# EAGLE design 2020_IST_Respirator_SMD_v3 (EAGLE 7.7.0)

## Sheet 1 of 4: Arduino Shield
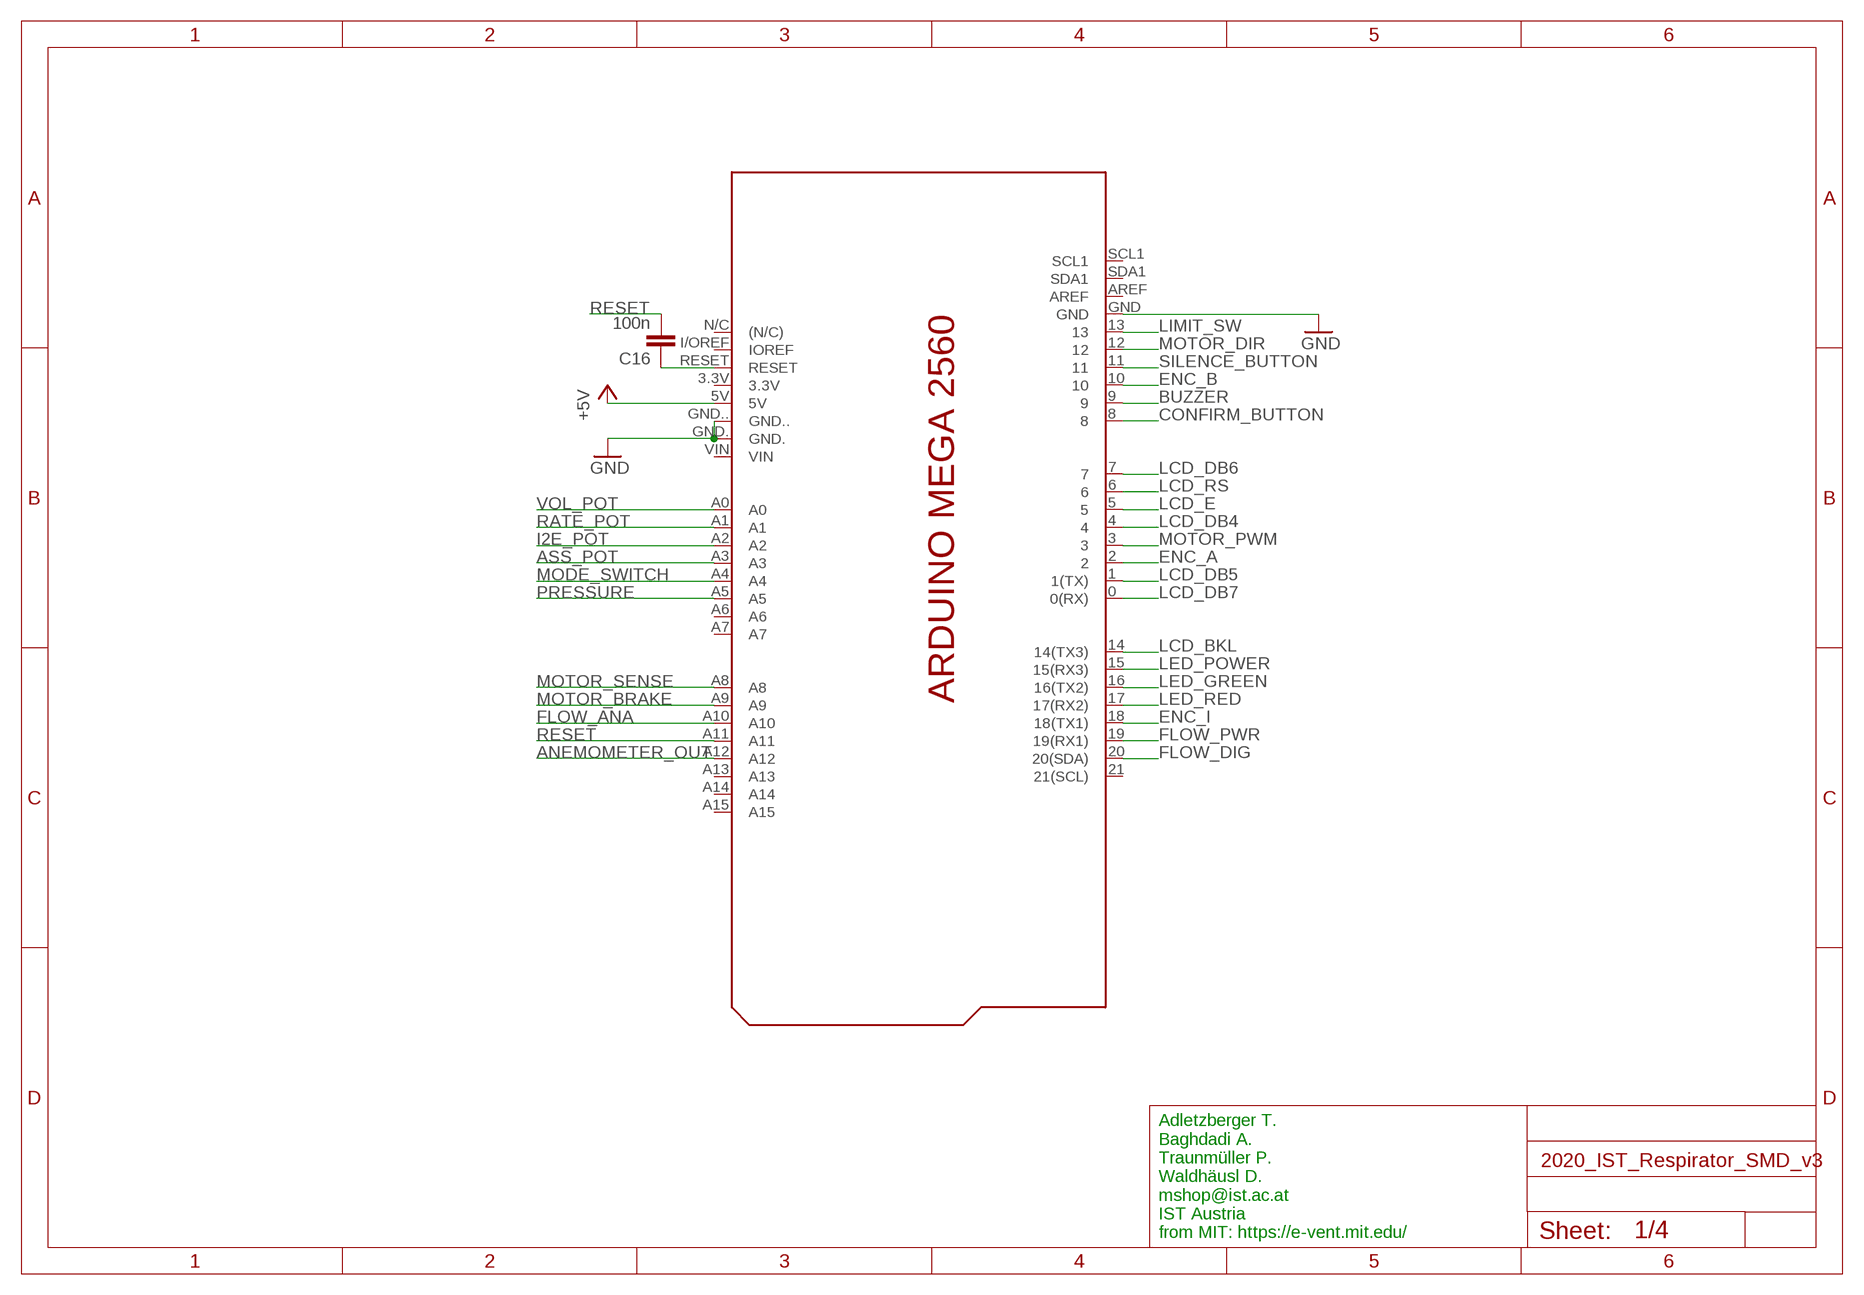
[diagram p0: schematic, sheet 1]

### Parts
C16  100n  C-EUC0805  [C0805]
PCB1  ARDUINO_MEGA2560_NOTALLPINS  [ARDUINO_MEGA2560_NOTALLPINS]

### Nets
+5V: PCB1.5V ; also sheet 2,3,4
ANEMOMETER_OUT: PCB1.A12
ASS_POT: PCB1.A3 ; also sheet 3
BUZZER: PCB1.9 ; also sheet 3
CONFIRM_BUTTON: PCB1.8 ; also sheet 3
ENC_A: PCB1.2 ; also sheet 4
ENC_B: PCB1.10 ; also sheet 4
ENC_I: PCB1.18(18(TX1)) ; also sheet 3,4
FLOW_ANA: PCB1.A10 ; also sheet 4
FLOW_DIG: PCB1.20(20(SDA)) ; also sheet 4
FLOW_PWR: PCB1.19(19(RX1)) ; also sheet 3,4
GND: PCB1.GND PCB1.GND. PCB1.GND.. ; also sheet 2,3,4
I2E_POT: PCB1.A2 ; also sheet 3
LCD_BKL: PCB1.14(14(TX3)) ; also sheet 3
LCD_DB4: PCB1.4 ; also sheet 3
LCD_DB5: PCB1.1(1(TX)) ; also sheet 3
LCD_DB6: PCB1.7 ; also sheet 3
LCD_DB7: PCB1.0(0(RX)) ; also sheet 3
LCD_E: PCB1.5 ; also sheet 3
LCD_RS: PCB1.6 ; also sheet 3
LED_GREEN: PCB1.16(16(TX2)) ; also sheet 3
LED_POWER: PCB1.15(15(RX3)) ; also sheet 3
LED_RED: PCB1.17(17(RX2)) ; also sheet 3
LIMIT_SW: PCB1.13 ; also sheet 3
MODE_SWITCH: PCB1.A4 ; also sheet 3
MOTOR_BRAKE: PCB1.A9
MOTOR_DIR: PCB1.12 ; also sheet 2
MOTOR_PWM: PCB1.3 ; also sheet 2
MOTOR_SENSE: PCB1.A8 ; also sheet 2
N$16: C16.1 PCB1.RESET
PRESSURE: PCB1.A5 ; also sheet 4
RATE_POT: PCB1.A1 ; also sheet 3
RESET: C16.2 PCB1.A11
SILENCE_BUTTON: PCB1.11 ; also sheet 3
VOL_POT: PCB1.A0 ; also sheet 3
Unconnected: PCB1.3.3V PCB1.21(21(SCL)) PCB1.A6 PCB1.A7 PCB1.A13 PCB1.A14 PCB1.A15 PCB1.AREF PCB1.I/OREF(IOREF) PCB1.N/C((N/C)) PCB1.SCL1 PCB1.SDA1 PCB1.VIN

### Notes on the sheet
- Adletzberger T.
  Baghdadi A.
  Traunmüller P.
  Waldhäusl D.
  mshop@ist.ac.at
  IST Austria 
  from MIT: https://e-vent.mit.edu/

## Sheet 2 of 4: Motor driver
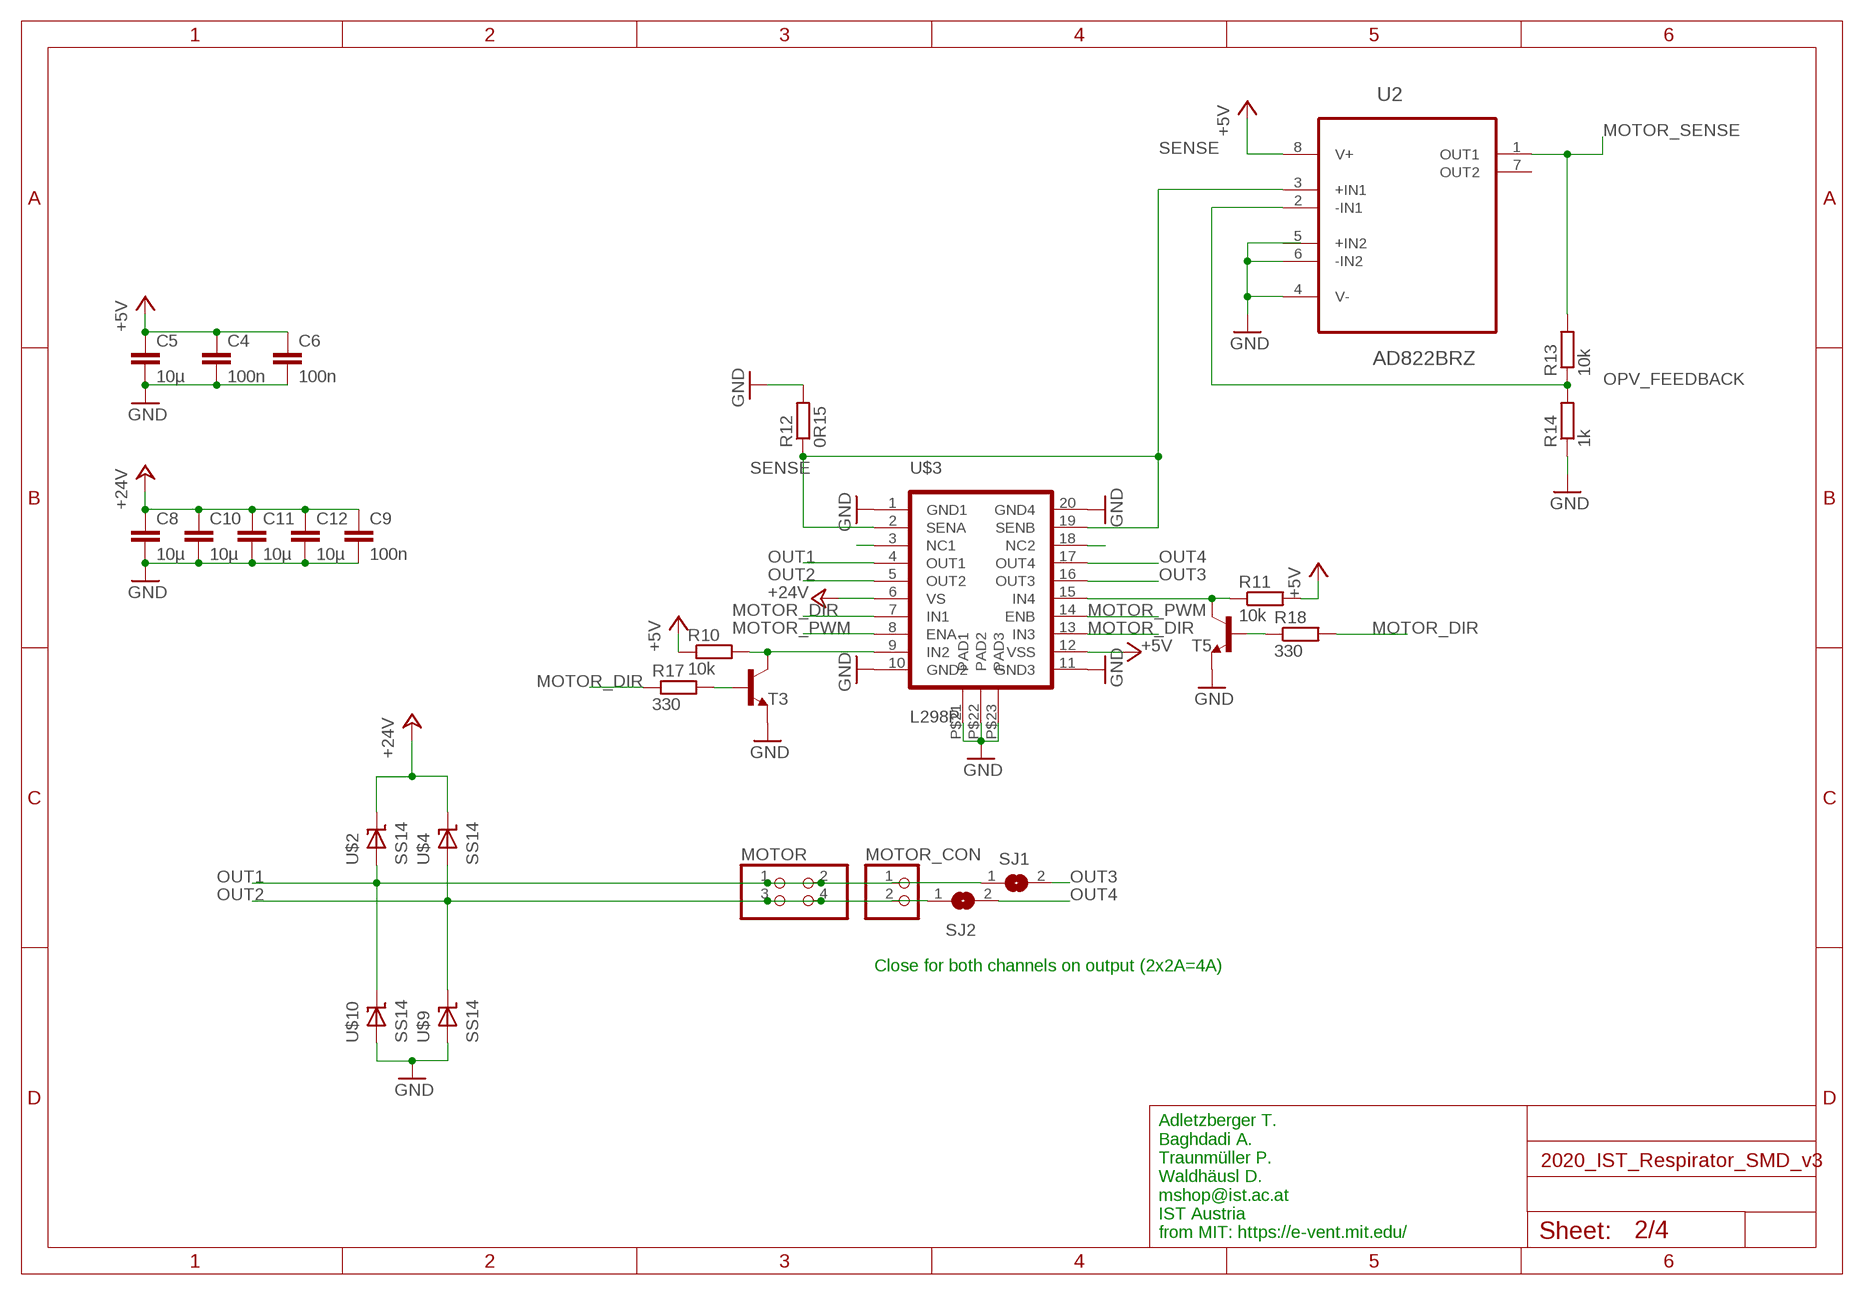
[diagram p1: schematic, sheet 2]

### Parts
C4  100n  C-EUC0805  [C0805]
C5  10µ  C-EUC1210  [C1210]
C6  100n  C-EUC0805  [C0805]
C8  10µ  C-EUC1210  [C1210]
C9  100n  C-EUC0805  [C0805]
C10  10µ  C-EUC1210  [C1210]
C11  10µ  C-EUC1210  [C1210]
C12  10µ  C-EUC1210  [C1210]
MOTOR  PINHD-2X2  [2X02]
MOTOR_CON  PINHD-1X2_3.93MM  [1X02_3.96MM]
R10  10k  R-EU_R0805  [R0805]
R11  10k  R-EU_R0805  [R0805]
R12  0R15  R-EU_R1206  [R1206]
R13  10k  R-EU_R0805  [R0805]
R14  1k  R-EU_R0805  [R0805]
R17  330  R-EU_R0805  [R0805]
R18  330  R-EU_R0805  [R0805]
SJ1  SJ  [SJ]
SJ2  SJ  [SJ]
T3  MMBT3904LT1-NPN-SOT23-BEC  [SOT23-BEC]
T5  MMBT3904LT1-NPN-SOT23-BEC  [SOT23-BEC]
U2  AD822BRZ  [SOIC127P600X175-8N]
U$2  SS14  [SMA]
U$3  L298P  [POWER-SO20]
U$4  SS14  [SMA]
U$9  SS14  [SMA]
U$10  SS14  [SMA]

### Nets
+5V: C4.1 C5.1 C6.1 R10.1 R11.2 U2.8(V+) U$3.P$12(VSS) ; also sheet 1,3,4
+24V: C8.1 C9.1 C10.1 C11.1 C12.1 U$2.P$1(K) U$3.P$6(VS) U$4.P$1(K) ; also sheet 3,4
DRIVER_IN2: R10.2 T3.C U$3.P$9(IN2)
DRIVER_INV4: R11.1 T5.C U$3.P$15(IN4)
GND: C4.2 C5.2 C6.2 C8.2 C9.2 C10.2 C11.2 C12.2 R12.2 R14.1 T3.E T5.E U2.4(V-) U2.6(-IN2) U$3.P$1(GND1) U$3.P$10(GND2) U$3.P$11(GND3) U$3.P$20(GND4) U$3.P$21(PAD1) U$3.P$22(PAD2) U$3.P$23(PAD3) U$9.P$2(A) U$10.P$2(A) ; also sheet 1,3,4
MOTOR_DIR: R17.1 R18.2 U$3.P$7(IN1) U$3.P$13(IN3) ; also sheet 1
MOTOR_PWM: U$3.P$8(ENA) U$3.P$14(ENB) ; also sheet 1
MOTOR_SENSE: R13.2 U2.1(OUT1) ; also sheet 1
N$8: U$3.P$18(NC2)
N$10: U$3.P$3(NC1)
N$14: R17.2 T3.B
N$15: R18.1 T5.B
OPV_FEEDBACK: R13.1 R14.2 U2.2(-IN1)
OUT1: MOTOR.1 MOTOR.2 MOTOR_CON.1 SJ1.1 U$2.P$2(A) U$3.P$4(OUT1) U$10.P$1(K)
OUT2: MOTOR.3 MOTOR.4 MOTOR_CON.2 SJ2.1 U$3.P$5(OUT2) U$4.P$2(A) U$9.P$1(K)
OUT3: SJ1.2 U$3.P$16(OUT3)
OUT4: SJ2.2 U$3.P$17(OUT4)
SENSE: R12.1 U2.3(+IN1) U$3.P$2(SENA) U$3.P$19(SENB)
Unconnected: U2.5(+IN2) U2.7(OUT2)

### Notes on the sheet
- Close for both channels on output (2x2A=4A)
- Adletzberger T.
  Baghdadi A.
  Traunmüller P.
  Waldhäusl D.
  mshop@ist.ac.at
  IST Austria 
  from MIT: https://e-vent.mit.edu/

## Sheet 3 of 4: Inputs & Outputs
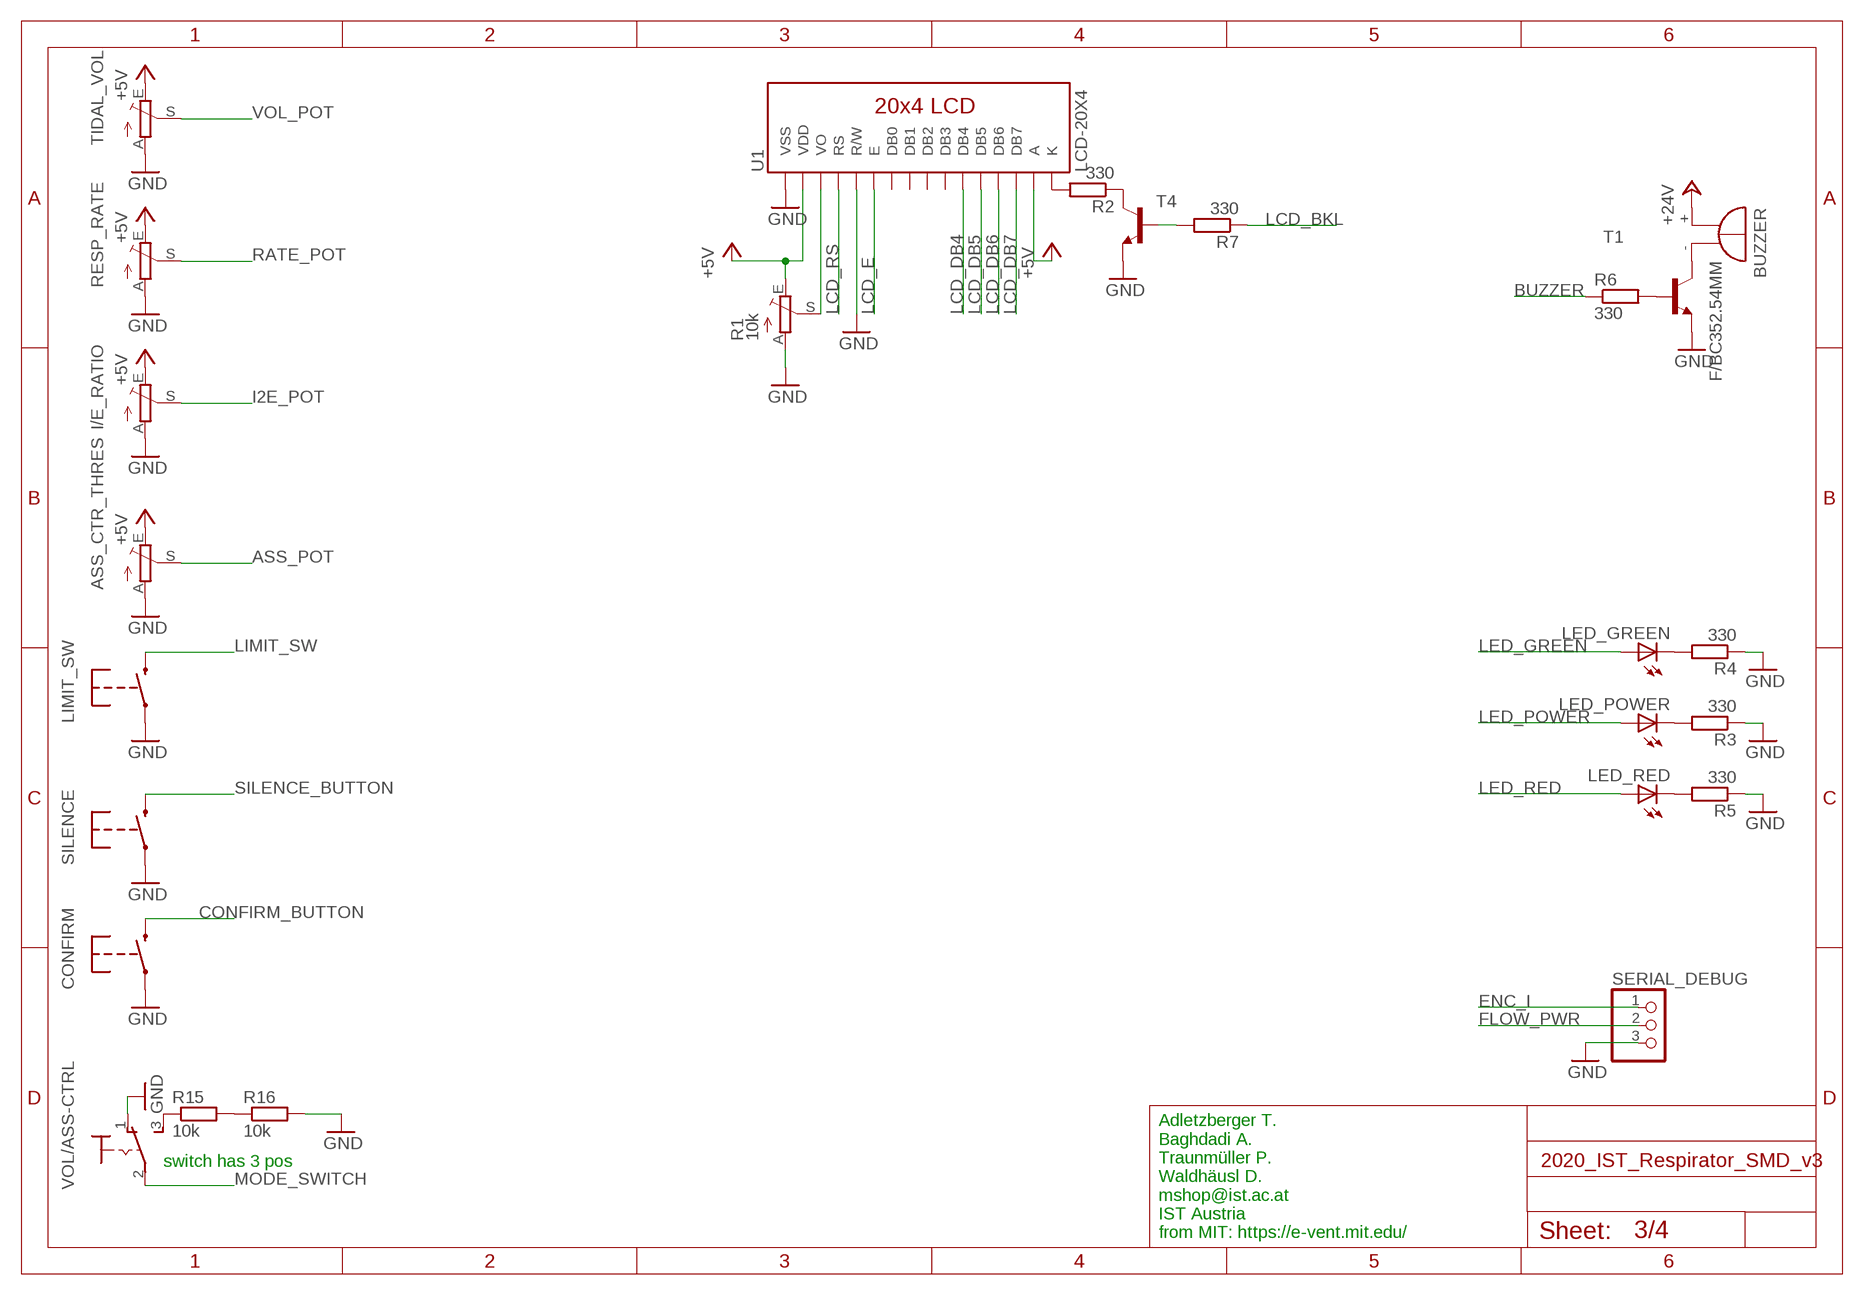
[diagram p2: schematic, sheet 3]

### Parts
ASS_CTR_THRES  TRIM_EU-ROUND  [S64W_ROUND-PADS]
BUZZER  F/BC352.54MM  [F/BC35_2.54MM]
CONFIRM  SWITCH-MOMENTARY-22.54  [TACTILE-2.54MM]
I/E_RATIO  TRIM_EU-ROUND  [S64W_ROUND-PADS]
LED_GREEN  LED5MM  [LED5MM]
LED_POWER  LED5MM  [LED5MM]
LED_RED  LED5MM  [LED5MM]
LIMIT_SW  SWITCH-MOMENTARY-22.54  [TACTILE-2.54MM]
R1  10k  TRIM_EU-S64W  [S64W]
R2  330  R-EU_R0805  [R0805]
R3  330  R-EU_R0805  [R0805]
R4  330  R-EU_R0805  [R0805]
R5  330  R-EU_R0805  [R0805]
R6  330  R-EU_R0805  [R0805]
R7  330  R-EU_R0805  [R0805]
R15  10k  R-EU_R0805  [R0805]
R16  10k  R-EU_R0805  [R0805]
RESP_RATE  TRIM_EU-ROUND  [S64W_ROUND-PADS]
SERIAL_DEBUG  PINHD-1X3  [1X03]
SILENCE  SWITCH-MOMENTARY-22.54  [TACTILE-2.54MM]
T1  MMBT3904LT1-NPN-SOT23-BEC  [SOT23-BEC]
T4  MMBT3904LT1-NPN-SOT23-BEC  [SOT23-BEC]
TIDAL_VOL  TRIM_EU-ROUND  [S64W_ROUND-PADS]
U1  LCD-20X4  [LCD-20X4]
VOL/ASS-CTRL  320-9162.54MM-ROUND-PADS  [320-916:2.54MM:ROUND-PADS]

### Nets
+5V: ASS_CTR_THRES.E I/E_RATIO.E R1.E RESP_RATE.E TIDAL_VOL.E U1.2(VDD) U1.15(A) ; also sheet 1,2,4
+24V: BUZZER.+ ; also sheet 2,4
ASS_POT: ASS_CTR_THRES.S ; also sheet 1
BUZZER: R6.1 ; also sheet 1
CONFIRM_BUTTON: CONFIRM.3 ; also sheet 1
ENC_I: SERIAL_DEBUG.1 ; also sheet 1,4
FLOW_PWR: SERIAL_DEBUG.2 ; also sheet 1,4
GND: ASS_CTR_THRES.A CONFIRM.1 I/E_RATIO.A LIMIT_SW.1 R1.A R3.1 R4.1 R5.1 R16.2 RESP_RATE.A SERIAL_DEBUG.3 SILENCE.1 T1.E T4.E TIDAL_VOL.A U1.1(VSS) U1.5(R/W) VOL/ASS-CTRL.1(O) ; also sheet 1,2,4
I2E_POT: I/E_RATIO.S ; also sheet 1
LCD_BKL: R7.1 ; also sheet 1
LCD_DB4: U1.11(DB4) ; also sheet 1
LCD_DB5: U1.12(DB5) ; also sheet 1
LCD_DB6: U1.13(DB6) ; also sheet 1
LCD_DB7: U1.14(DB7) ; also sheet 1
LCD_E: U1.6(E) ; also sheet 1
LCD_RS: U1.4(RS) ; also sheet 1
LED_GREEN: LED_GREEN.A ; also sheet 1
LED_POWER: LED_POWER.A ; also sheet 1
LED_RED: LED_RED.A ; also sheet 1
LIMIT_SW: LIMIT_SW.3 ; also sheet 1
MODE_SWITCH: VOL/ASS-CTRL.2(P) ; also sheet 1
N$4: BUZZER.- T1.C
N$5: R6.2 T1.B
N$6: R2.1 T4.C
N$7: R7.2 T4.B
N$9: R15.1 VOL/ASS-CTRL.3(S)
N$11: R15.2 R16.1
N$34: R2.2 U1.16(K)
N$37: R1.S U1.3(VO)
N$38: LED_GREEN.K(C) R4.2
N$39: LED_POWER.K(C) R3.2
N$40: LED_RED.K(C) R5.2
RATE_POT: RESP_RATE.S ; also sheet 1
SILENCE_BUTTON: SILENCE.3 ; also sheet 1
VOL_POT: TIDAL_VOL.S ; also sheet 1
Unconnected: U1.7(DB0) U1.8(DB1) U1.9(DB2) U1.10(DB3)

### Notes on the sheet
- switch has 3 pos
- Adletzberger T.
  Baghdadi A.
  Traunmüller P.
  Waldhäusl D.
  mshop@ist.ac.at
  IST Austria 
  from MIT: https://e-vent.mit.edu/

## Sheet 4 of 4: Supply & Sensors
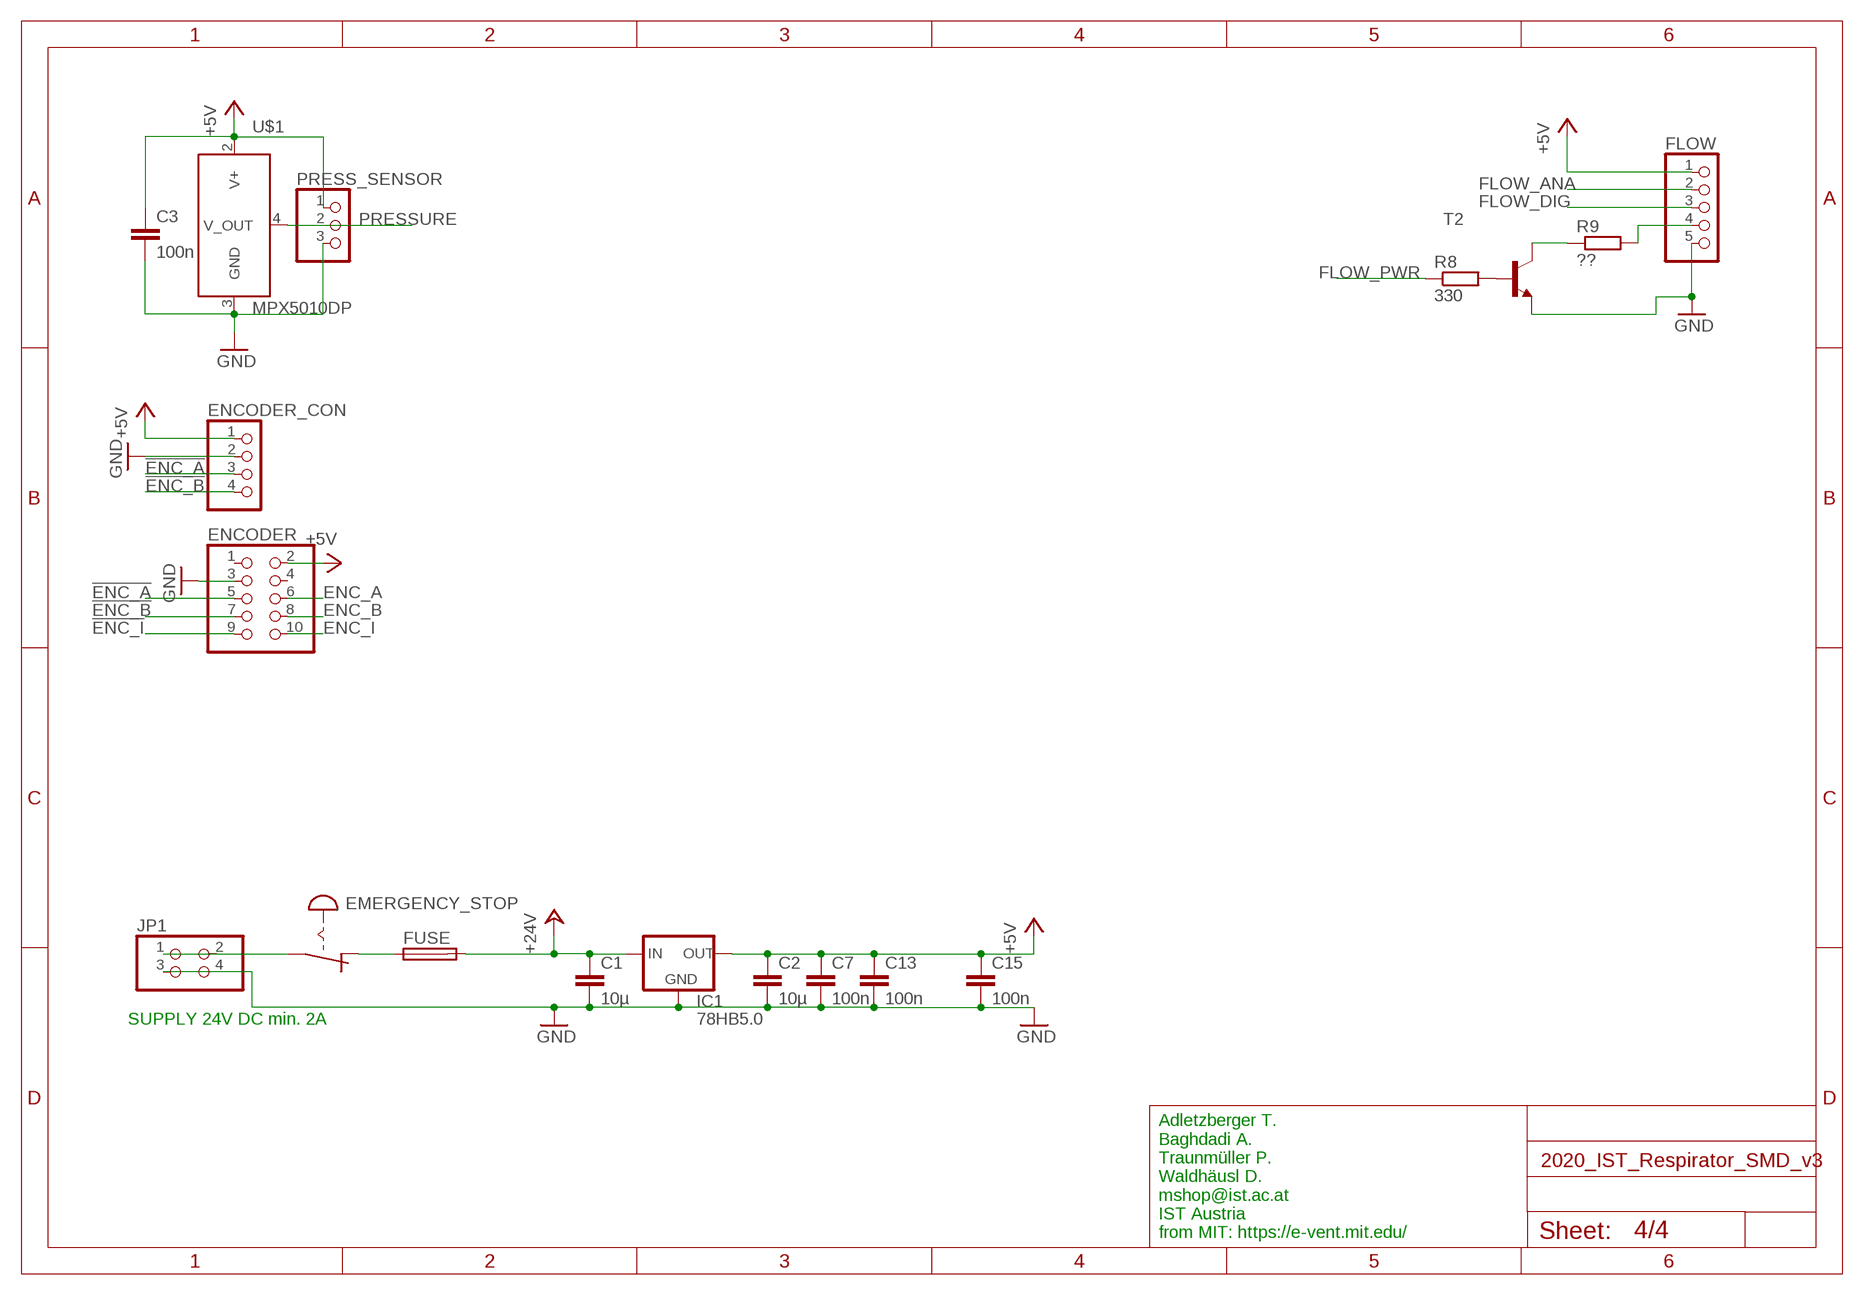
[diagram p3: schematic, sheet 4]

### Parts
C1  10µ  C-EUC1210  [C1210]
C2  10µ  C-EUC1210  [C1210]
C3  100n  C-EUC0805  [C0805]
C7  100n  C-EUC0805  [C0805]
C13  100n  C-EUC0805  [C0805]
C15  100n  C-EUC0805  [C0805]
EMERGENCY_STOP  EMERGENCY_STOP  [320-916:2.54MM:ROUND-PAD_2PINS]
ENCODER  PINHD-2X5  [2X05]
ENCODER_CON  PINHD-1X42MM  [1_04X2MM]
FLOW  PINHD-1X5  [1X05]
FUSE  SH22,5  [SH22,5]
IC1  78HB5.0  78XXS  [R-78HB]
JP1  PINHD-2X2  [2X02]
PRESS_SENSOR  PINHD-1X3  [1X03]
R8  330  R-EU_R0805  [R0805]
R9  ??  R-EU_R0805  [R0805]
T2  MMBT3904LT1-NPN-SOT23-BEC  [SOT23-BEC]
U$1  MPX5010DP  [MPX5010DP_SOP482]

### Nets
!ENC_A: ENCODER.5 ENCODER_CON.3
!ENC_B: ENCODER.7 ENCODER_CON.4
!ENC_I: ENCODER.9
+5V: C2.1 C3.1 C7.1 C13.1 C15.1 ENCODER.2 ENCODER_CON.1 FLOW.1 IC1.OUT PRESS_SENSOR.1 U$1.2(V+) ; also sheet 1,2,3
+24V: C1.1 FUSE.2 IC1.IN ; also sheet 2,3
ENC_A: ENCODER.6 ; also sheet 1
ENC_B: ENCODER.8 ; also sheet 1
ENC_I: ENCODER.10 ; also sheet 1,3
FLOW_ANA: FLOW.2 ; also sheet 1
FLOW_DIG: FLOW.3 ; also sheet 1
FLOW_PWR: R8.1 ; also sheet 1,3
GND: C1.2 C2.2 C3.2 C7.2 C13.2 C15.2 ENCODER.3 ENCODER_CON.2 FLOW.5 IC1.GND JP1.3 JP1.4 PRESS_SENSOR.3 T2.E U$1.3(GND) ; also sheet 1,2,3
N$1: R8.2 T2.B
N$2: R9.1 T2.C
N$3: FLOW.4 R9.2
N$12: EMERGENCY_STOP.2 JP1.1 JP1.2
N$13: EMERGENCY_STOP.1 FUSE.1
PRESSURE: PRESS_SENSOR.2 U$1.4(V_OUT) ; also sheet 1
Unconnected: ENCODER.1 ENCODER.4

### Notes on the sheet
- SUPPLY 24V DC min. 2A
- Adletzberger T.
  Baghdadi A.
  Traunmüller P.
  Waldhäusl D.
  mshop@ist.ac.at
  IST Austria 
  from MIT: https://e-vent.mit.edu/

## Library data of the parts
ASS_CTR_THRES I/E_RATIO R1 RESP_RATE TIDAL_VOL = pot:TRIM_EU-: POTENTIOMETER
BUZZER = buzzer:F/BC35: BUZZER Source: Spoerle
C1-C13 C15 C16 = rcl:C-EU: CAPACITOR, European symbol
CONFIRM LIMIT_SW SILENCE = SparkFun:SWITCH-MOMENTARY-2
EMERGENCY_STOP = switch:EMERGENCY_STOP: Emergency SWITCH distributor RS Components
ENCODER = pinhead:PINHD-2X5: PIN HEADER
ENCODER_CON = pinhead:PINHD-1X4: PIN HEADER
FLOW = pinhead:PINHD-1X5: PIN HEADER
FUSE = fuse:SH22,5: FUSE HOLDER grid 22,5 mm, OGN0031 8201, Schurter (Buerklin); MF: SCHURTER; MPN: 0031.8201; OC_FARNELL: 1162740; OC_NEWARK: 96F8317
IC1 = v-reg:78XXS: VOLTAGE REGULATOR
JP1 MOTOR = pinhead:PINHD-2X2: PIN HEADER
LED_GREEN LED_POWER LED_RED = led:LED: LED OSRAM: - CHIPLED LG R971, LG N971, LY N971, LG Q971, LY Q971, LO R971, LY R971 LH N974, LH R974 LS Q976, LO Q976, LY Q976 LO Q996 - Hyper CHIPLED LW Q18S LB Q993, LB Q99A, LB R99A - SideLED LS A670, LO A670, LY A670, LG A670, LP A670 LB A673, LV A673, LT A673, LW A673 LH A674 LY A675 LS A676, LA A676, LO A676, LY A676, LW A676 LS A679, LY A679, LG A679 - Hyper Micro SIDELED® LS Y876, LA Y876, LO Y876, LY Y876 LT Y87S - SmartLED LW L88C, LW L88S LB L89C, LB L89S, LG L890 LS L89K, LO L89K, LY L89K LS L896, LA L896, LO L896, LY L896 - TOPLED LS T670, LO T670, LY T670, LG T670, LP T670 LSG T670, LSP T670, LSY T670, LOP T670, LYG T670 LG T671, LOG T671, LSG T671 LB T673, LV T673, LT T673, LW T673 LH T674 LS T676, LA T676, LO T676, LY T676, LB T676, LH T676, LSB T676, LW T676 LB T67C, LV T67C, LT T67C, LS T67K, LO T67K, LY T67K, LW E67C LS E67B, LA E67B, LO E67B, LY E67B, LB E67C, LV E67C, LT E67C LW T67C LS T679, LY T679, LG T679 LS T770, LO T770, LY T770, LG T770, LP T770 LB T773, LV T773, LT T773, LW T773 LH T774 LS E675, LA E675, LY E675, LS T675 LS T776, LA T776, LO T776, LY T776, LB T776 LHGB T686 LT T68C, LB T68C - Hyper Mini TOPLED® LB M676 - Mini TOPLED Santana® LG M470 LS M47K, LO M47K, LY M47K Source: http://www.osram.convergy.de LUXEON: - LUMILED® LXK2-PW12-R00, LXK2-PW12-S00, LXK2-PW14-U00, LXK2-PW14-V00 LXK2-PM12-R00, LXK2-PM12-S00, LXK2-PM14-U00 LXK2-PE12-Q00, LXK2-PE12-R00, LXK2-PE12-S00, LXK2-PE14-T00, LXK2-PE14-U00 LXK2-PB12-K00, LXK2-PB12-L00, LXK2-PB12-M00, LXK2-PB14-N00, LXK2-PB14-P00, LXK2-PB14-Q00 LXK2-PR12-L00, LXK2-PR12-M00, LXK2-PR14-Q00, LXK2-PR14-R00 LXK2-PD12-Q00, LXK2-PD12-R00, LXK2-PD12-S00 LXK2-PH12-R00, LXK2-PH12-S00 LXK2-PL12-P00, LXK2-PL12-Q00, LXK2-PL12-R00 Source: www.luxeon.com KINGBRIGHT: KA-3528ASYC Source: www.kingbright.com
MOTOR_CON = pinhead:PINHD-1X2: PIN HEADER
PCB1 = E14_Arduino_revB:ARDUINO_MEGA2560_NOTALLPINS: Device for representing an Arduino Mega 2560 board with a footprint in an EAGLE design. Created by Dave Young for Element14. More EAGLE documentation at: http://www.element14.com/community/community/knode/cadsoft_eagle
PRESS_SENSOR SERIAL_DEBUG = pinhead:PINHD-1X3: PIN HEADER
R2-R18 = rcl:R-EU_: RESISTOR, European symbol
SJ1 SJ2 = jumper:SJ: SMD solder JUMPER
T1-T5 = transistor:*-NPN-: NPN Transistror BF959 corrected 2008.03.06
U1 = SparkFun:LCD-20X4
U2 = Analog Devices_By_element14_Batch_1:AD822BRZ: Single-Supply, Rail-to-Rail Single-Supply, Rail-to-Rail Low Power FET-Input Op Amp; MPN: AD822BRZ; OC_FARNELL: 1651303; OC_NEWARK: 59K6493; PACKAGE: SOIC-8; SUPPLIER: Analog Devices
U$1 = SparkFun:MPX5010DP: MPX5010 Pressure Sensor Differential/Gauge Pressure Sensors up to 10 kPa, NXP MEMS-based low-pressure differential/gauge sensors measure the difference in pressure between sources when pressure is applied to both sides of the sensor (differential) and atmospheric pressure (gauged). Pressure Sensors, NXP RS Stock No. 922-7409 Mfr. Part No. MPXV5010DP
U$2 U$4 U$9 U$10 = SmartPrj:SS14: DIODE SS14 Diode Schottky 1A 40v
U$3 = SmartPrj:L298P: L298P DUAL FUL-BRIDGE DRIVER PowerSO20
VOL/ASS-CTRL = switch:320-916: TOGGLE SWITCH distributor RS Components

## Net classes
0 default: clearance 0.205 mm

## Board
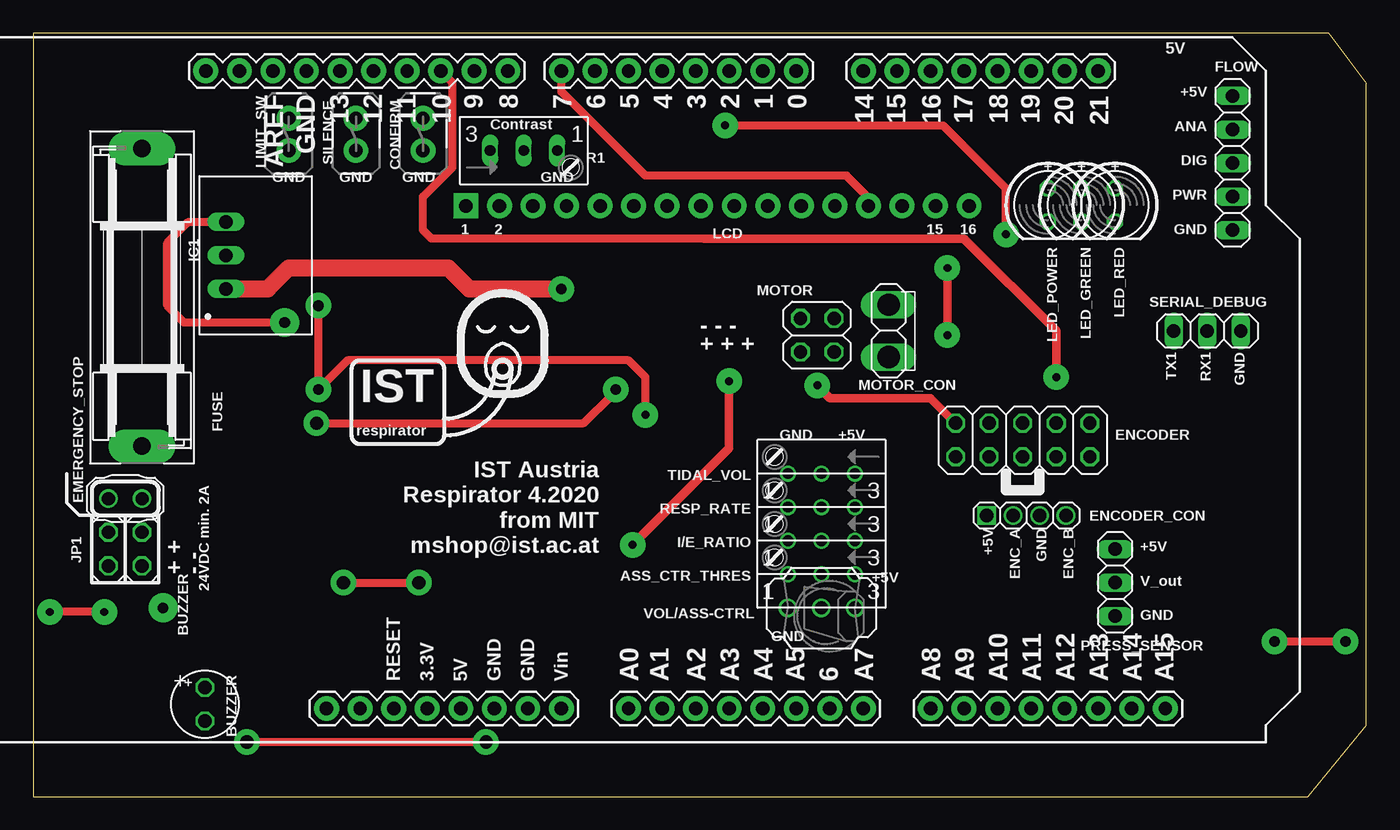
[diagram p4: board, top side]
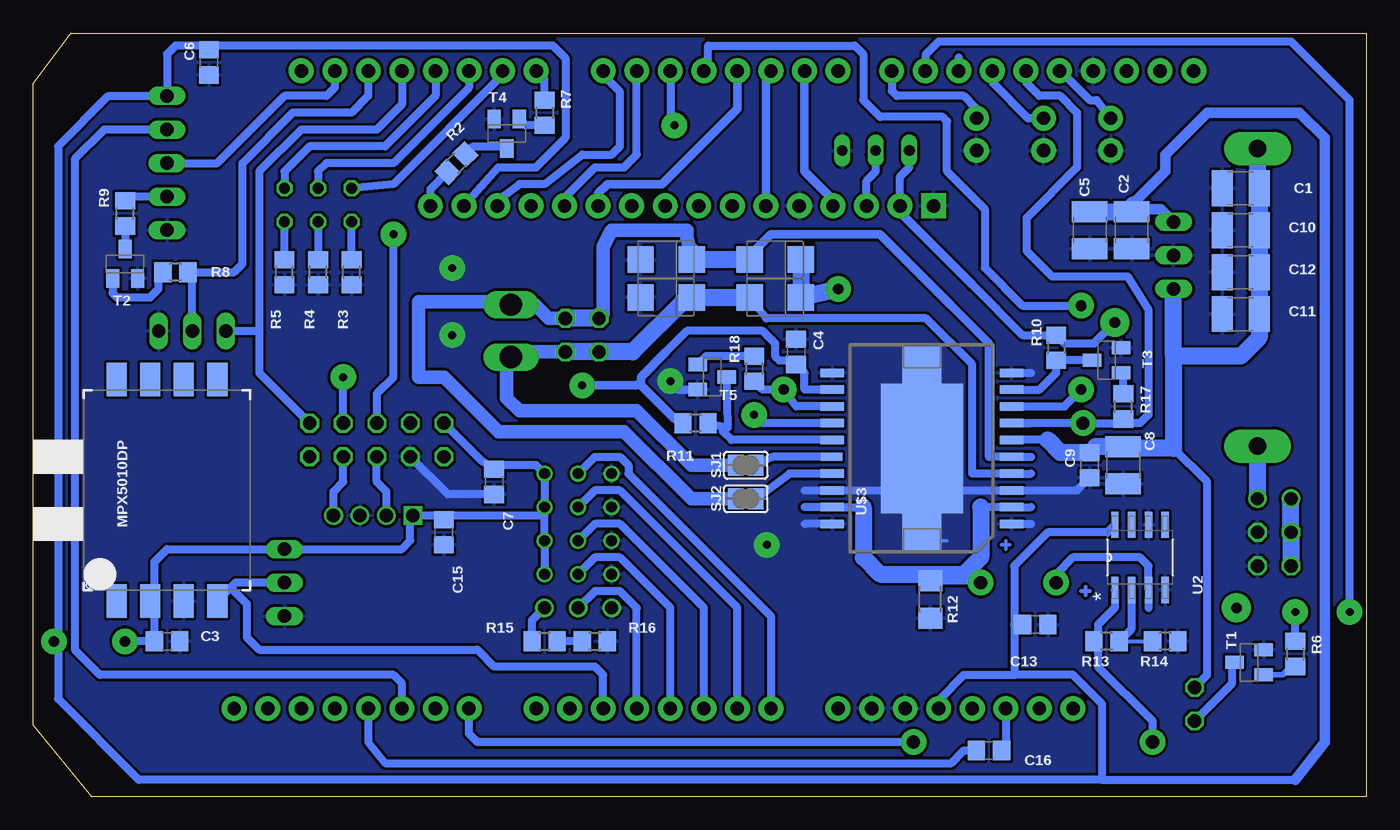
[diagram p5: board, bottom side, seen from below]

Size 100.95 x 57.79 mm. Coordinates in mm from the lower left corner, seen from the top.
Outline: 0,0 96.52,0 100.95,5.4 100.95,53.97 98.11,57.79 0,57.79 0,0
Copper layers (1*16): Top 0.035mm / dielectric 1.5mm / Bottom 0.035mm
Design rules "PCB-POOL Standard": minimum track width 0.15mm, minimum drill 0.3mm, track to track 0.15mm, track to pad 0.15mm, pad to pad 0.15mm, via to via 0.15mm, smd to smd 0.15mm, copper to edge 0.3mm, drill to drill 0.2mm, minimum pad ring 0.2mm, minimum via ring 0.15mm, stop-mask expansion 0.075mm, vias tented up to drill 0mil, thermal gap 0.2mm

### Footprints (pad centres in the part's own frame; a part is rotated, then mirrored left to right if it is on the bottom)
S64W_ROUND-PADS = drill 0.813: A 2.54,1.27; E -2.54,1.27; S 0,1.27
F/BC35_2.54MM = drill 1 octagon: + 1.27,0; - -1.27,0
C1210 = smd 1.6 x 2.7: 1 -1.4,0; 2 1.4,0
C0805 = smd 1.3 x 1.5: 1 -0.95,0; 2 0.95,0
TACTILE-2.54MM = drill 1.016 pad 1.88: 1 0,1.27; 3 0,-1.17
320-916:2.54MM:ROUND-PAD_2PINS = drill 1: 1 0,2.54; 2 0,0
2X05 = drill 1.016 octagon: 1 -5.08,-1.27; 2 -5.08,1.27; 3 -2.54,-1.27; 4 -2.54,1.27; 5 0,-1.27; 6 0,1.27; 7 2.54,-1.27; 8 2.54,1.27; 9 5.08,-1.27; 10 5.08,1.27
1_04X2MM = drill 1.016 pad 1.3 square: 1 -4,0 | drill 1.016 pad 1.3: 2 0,0; 3 -2,0; 4 2,0
1X05 = drill 1.016 long: 1 -5.08,0; 2 -2.54,0; 3 0,0; 4 2.54,0; 5 5.08,0
SH22,5 = drill 1.321 pad 2.54 long: 1 -11.252,0; 2 11.252,0
R-78HB = drill 1.016 long: GND 0,0; IN -2.54,0; OUT 2.54,0
2X02 = drill 1.016 octagon: 1 -1.27,-1.27; 2 -1.27,1.27; 3 1.27,-1.27; 4 1.27,1.27
LED5MM = drill 0.813 octagon: A -1.27,0; K 1.27,0
1X02_3.96MM = drill 1.7 long: 1 1.98,0; 2 -1.98,0
ARDUINO_MEGA2560_NOTALLPINS = drill 1.016 pad 1.88: 0 63.5,50.8; 1 60.96,50.8; 2 58.42,50.8; 3 55.88,50.8; 3.3V 35.56,2.54; 4 53.34,50.8; 5 50.8,50.8; 5V 38.1,2.54; 6 48.26,50.8; 7 45.72,50.8; 8 41.656,50.8; 9 39.116,50.8; 10 36.576,50.8; 11 34.036,50.8; 12 31.496,50.8; 13 28.956,50.8; 14 68.58,50.8; 15 71.12,50.8; 16 73.66,50.8; 17 76.2,50.8; 18 78.74,50.8; 19 81.28,50.8; 20 83.82,50.8; 21 86.36,50.8; A0 50.8,2.54; A1 53.34,2.54; A2 55.88,2.54; A3 58.42,2.54; A4 60.96,2.54; A5 63.5,2.54; A6 66.04,2.54; A7 68.58,2.54; A8 73.66,2.54; A9 76.2,2.54; A10 78.74,2.54; A11 81.28,2.54; A12 83.82,2.54; A13 86.36,2.54; A14 88.9,2.54; A15 91.44,2.54; AREF 23.876,50.8; GND 26.416,50.8; GND. 43.18,2.54; GND.. 40.64,2.54; I/OREF 30.48,2.54; N/C 27.94,2.54; RESET 33.02,2.54; SCL1 18.796,50.8; SDA1 21.336,50.8; VIN 45.72,2.54
1X03 = drill 1.016 long: 1 -2.54,0; 2 0,0; 3 2.54,0
S64W = drill 0.813 long: A 2.54,1.27; E -2.54,1.27; S 0,1.27
R0805 = smd 1.3 x 1.5: 1 -0.95,0; 2 0.95,0
R1206 = smd 1.6 x 1.803: 1 -1.422,0; 2 1.422,0
SJ = smd 1.168 x 1.6: 1 -0.762,0; 2 0.762,0
SOT23-BEC = smd 1 x 1.4: B -0.95,-1.1; C 0,1.1; E 0.95,-1.1
LCD-20X4 = drill 1.016 pad 1.88 square: 1 -19.3,0.26 | drill 1.016 pad 1.88: 2 -16.76,0.26; 3 -14.22,0.26; 4 -11.68,0.26; 5 -9.14,0.26; 6 -6.6,0.26; 7 -4.06,0.26; 8 -1.52,0.26; 9 1.02,0.26; 10 3.56,0.26; 11 6.1,0.26; 12 8.64,0.26; 13 11.18,0.26; 14 13.72,0.26; 15 16.26,0.26; 16 18.8,0.26
SOIC127P600X175-8N = smd 1.981 x 0.559: 1 -2.464,1.905; 2 -2.464,0.635; 3 -2.464,-0.635; 4 -2.464,-1.905; 5 2.464,-1.905; 6 2.464,-0.635; 7 2.464,0.635; 8 2.464,1.905
MPX5010DP_SOP482 = smd 2.54 x 1.524: 1 -8.382,3.81; 2 -8.382,1.27; 3 -8.382,-1.27; 4 -8.382,-3.81; 5 8.382,-3.81; 6 8.382,-1.27; 7 8.382,1.27; 8 8.382,3.81
SMA = smd 2 x 2: P$1 -1.94,0; P$2 1.94,0
POWER-SO20 = smd 0.635 x 1.778: P$1 -5.715,-6.782; P$2 -4.445,-6.782; P$3 -3.175,-6.782; P$4 -1.905,-6.782; P$5 -0.635,-6.782; P$6 0.635,-6.782; P$7 1.905,-6.782; P$8 3.175,-6.782; P$9 4.445,-6.782; P$10 5.715,-6.782; P$11 5.715,6.782; P$12 4.445,6.782; P$13 3.175,6.782; P$14 1.905,6.782; P$15 0.635,6.782; P$17 -1.905,6.782; P$18 -3.175,6.782; P$19 -4.445,6.782; P$20 -5.715,6.782 | smd 0.635 x 1.651: P$16 -0.635,6.833 | smd 9.804 x 6.198: P$21 0,0 | smd 3.048 x 2.921: P$22 -6.426,0; P$23 6.426,0
320-916:2.54MM:ROUND-PADS = drill 1: 1 0,2.54; 2 0,0; 3 0,-2.54

### Placement (x,y rotation side)
ASS_CTR_THRES  59.69,18.1 180 top
BUZZER  13.02,6.99 90 top
C1  9.53,46.04 180 bottom
C2  17.78,42.86 270 bottom
C3  90.81,11.75 0 bottom
C4  43.18,33.66 90 bottom
C5  20.95,42.86 270 bottom
C6  87.63,55.56 270 bottom
C7  66.04,23.81 270 bottom
C8  18.41,25.08 270 bottom
C9  20.95,25.08 270 bottom
C10  9.53,42.86 180 bottom
C11  9.53,36.51 180 bottom
C12  9.53,39.69 180 bottom
C13  25.08,13.02 0 bottom
C15  69.85,20 270 bottom
C16  28.57,3.49 180 bottom
CONFIRM  29.53,50.16 180 top
EMERGENCY_STOP  5.71,22.54 270 top
ENCODER  74.93,26.99 0 top
ENCODER_CON  76.2,21.27 0 top
FLOW  90.81,47.94 270 top
FUSE  8.25,37.78 90 top
I/E_RATIO  59.69,20.64 180 top
IC1  14.61,40.96 90 top
JP1  6.99,18.73 0 top
LED_GREEN  79.38,44.77 270 top
LED_POWER  76.84,44.77 270 top
LED_RED  81.92,44.77 270 top
LIMIT_SW  19.37,50.16 180 top
MOTOR  59.37,34.93 90 top
MOTOR_CON  64.77,35.24 270 top
PCB1  -5.72,4.13 0 top
PRESS_SENSOR  81.92,16.19 270 top
R1  37.15,47.62 0 top
R2  68.9,47.94 225 bottom
R3  76.84,39.69 90 bottom
R4  79.38,39.69 90 bottom
R5  81.92,39.69 90 bottom
R6  5.4,10.79 270 bottom
R7  62.23,51.75 270 bottom
R8  90.17,39.69 180 bottom
R9  93.98,44.13 90 bottom
R10  23.49,33.97 270 bottom
R11  50.8,28.26 180 bottom
R12  33.02,14.92 270 bottom
R13  19.68,11.75 180 bottom
R14  15.24,11.75 180 bottom
R15  62.23,11.75 0 bottom
R16  58.42,11.75 0 bottom
R17  18.41,29.53 90 bottom
R18  46.35,32.39 270 bottom
RESP_RATE  59.69,23.18 180 top
SERIAL_DEBUG  88.9,35.24 0 top
SILENCE  24.45,50.16 180 top
SJ1  46.99,25.08 0 bottom
SJ2  46.99,22.54 0 bottom
T1  8.89,10.16 90 bottom
T2  93.98,40.32 0 bottom
T3  19.68,33.02 90 bottom
T4  65.09,50.16 180 bottom
T5  49.53,31.75 270 bottom
TIDAL_VOL  59.69,25.72 180 top
U1  52.07,44.45 0 top
U2  17.14,18.1 90 bottom
U$1  90.81,23.18 90 bottom
U$2  44.77,37.78 180 bottom
U$3  33.66,26.35 90 bottom
U$4  44.77,40.64 180 bottom
U$9  53.02,40.64 180 bottom
U$10  53.02,37.78 180 bottom
VOL/ASS-CTRL  59.69,14.29 90 top

### Tracks (layer width: path | path; a pad name or v marks a point on that pad's centre or on a via)
!ENC_A
  Bottom 0.61: ENCODER_CON.3 74.2,23.08 74.93,23.81 ENCODER.5
!ENC_B
  Bottom 0.61: ENCODER_CON.4 78.2,23.08 77.47,23.81 ENCODER.7
+5V  (via drill 0.6 pad 1.93, 0.8 pad 1.93, 0.8 pad 2.18)
  Top 0.61: v93.98,11.75 v99.38,11.75 | 67.95,30.16 ENCODER.2 | v19.05,35.88 11.43,35.88 10.16,37.15 10.16,41.91 11.75,43.5 IC1.OUT
  Top 0.64: 67.95,30.16 60.32,30.16 v59.37,31.11
  Bottom 0.61: 91.76,14.48 C3.1 v93.98,11.75 | 91.76,14.48 U$1.2 | 69.85,21.27 ENCODER_CON.1 72.39,21.08 72.39,19.37 73.03,18.73 PRESS_SENSOR.1 90.81,18.73 91.76,17.78 91.76,14.48 | 69.85,21.27 62.23,21.27 | 62.23,21.27 RESP_RATE.E TIDAL_VOL.E 62.87,25.08 66.36,25.08 C7.1 66.99,25.4 ENCODER.2 | ASS_CTR_THRES.E I/E_RATIO.E 62.23,21.27 | C15.1 69.85,21.27 | U$3.P$12 42.54,30.8 42.54,32.07 C4.1 43.49,33.02 44.45,33.02 44.77,33.34 44.77,34.29 45.72,35.24 51.44,35.24 53.02,33.65 | 99.06,11.75 99.06,49.21 95.25,53.02 FLOW.1 90.81,56.2 90.17,56.83 87.63,56.83 | 99.06,11.75 99.06,7.39 92.94,1.27 20,1.27 | PCB1.5V 32.38,7.3 30.48,9.21 26.67,9.21 | v99.38,11.75 99.06,11.75 | 26.67,13.02 26.67,17.46 24.13,20 19.61,20 U2.8 | 26.67,13.02 26.67,9.21 | 26.67,9.21 22.22,9.21 20,6.99 20,1.27 | 87.63,56.83 61.59,56.83 60.64,55.88 60.64,49.85 62.87,47.62 65.72,47.62 U1.15 | R11.2 51.75,28.57 | C13.1 26.67,13.02 | v19.05,35.88 20.64,34.29 22.86,34.29 R10.1 26.03,34.92 29.84,38.73 | R1.E 34.61,47.62 35.31,46.92 U1.2 | 20,1.27 5.4,1.27 | C6.1 87.63,56.83
  Bottom 0.64: 53.02,33.65 54.93,31.75 54.93,31.43 | 54.93,31.43 54.93,31.11 52.39,28.58 52.07,28.58 R11.2 | v59.37,31.11 55.24,31.11 54.93,31.43 | 29.84,38.73 35.24,44.13 35.24,44.64 U1.2
  Bottom 0.813: 5.4,1.27 3.17,4.13 3.17,49.85 5.08,51.75 12.07,51.75 15.24,48.58 15.24,47.31 17.65,44.9 17.65,44.77 17.33,44.45 15.56,44.45 IC1.OUT
  Bottom 1.27: 17.65,44.77 C2.1 C5.1
+24V  (via drill 0.8 pad 1.93)
  Top 1.27: IC1.IN 17.78,38.42 19.37,40.01 31.43,40.01 33.02,38.42 v40.01,38.42
  Bottom 0.61: 24.13,26.99 U$3.P$6 | BUZZER.+ 12.07,9.21 12.07,23.81 14.61,26.35
  Bottom 1.27: FUSE.2 8.25,46.8 C1.1 C10.1 C12.1 C11.1 | C11.1 8.12,36.01 8.25,35.88 8.25,37.02 C11.1 | C11.1 8.12,34.74 9.53,33.34 14.61,33.34 | 14.61,33.34 IC1.IN | U$4.P$1 U$2.P$1 v40.01,38.42 | 14.61,33.34 14.61,26.35 18.29,26.35 C8.1 20.5,26.48 C9.1 23.18,26.03 24.13,26.99
ASS_POT
  Bottom 0.61: PCB1.A3 52.7,14.29 56.52,18.1 58.42,18.1 ASS_CTR_THRES.S
BUZZER  (via drill 0.6 pad 1.93)
  Top 0.61: v5.4,13.97 v1.27,13.97
  Bottom 0.61: PCB1.9 33.34,54.99 33.34,56.2 32.38,57.15 5.71,57.15 1.27,52.71 v1.27,13.97 | R6.1 v5.4,13.97
CONFIRM_BUTTON
  Bottom 0.61: PCB1.8 35.94,53.4 35.56,53.02 30.48,53.02 29.53,52.07 CONFIRM.3
DRIVER_IN2
  Bottom 0.61: U$3.P$9 24.77,30.8 23.49,32.07 R10.2 T3.C
DRIVER_INV4
  Bottom 0.61: U$3.P$15 48.09,26.99 48.73,27.62 48.35,27.92 | 48.35,27.92 T5.C | R11.1 49.83,28.24 48.35,27.92
ENC_A  (via drill 0.6 pad 1.93)
  Top 0.61: v52.39,50.8 68.9,50.8 73.66,46.04 v73.66,42.54
  Bottom 0.61: PCB1.2 52.7,51.12 v52.39,50.8 | ENCODER.6 74.93,30.48 73.66,31.75 v73.66,42.54
ENC_B  (via drill 0.6 pad 1.93)
  Top 0.61: v77.47,31.75 77.15,31.75 | 50.8,42.23 30.16,42.23 29.53,42.86 29.53,45.4 31.75,47.62 31.75,54.04 PCB1.10
  Top 0.64: 50.8,42.23 70.48,42.23 77.47,35.24 v77.47,31.75
  Bottom 0.61: PCB1.10 30.86,55.94 | ENCODER.8 v77.47,31.75
ENC_I
  Bottom 0.61: PCB1.18 73.03,52.39 74.93,50.48 80.65,50.48 83.82,47.31 83.82,35.24 | 83.82,35.24 83.82,32.07 ENCODER.10 | SERIAL_DEBUG.1 83.82,35.24
FLOW_ANA
  Bottom 0.61: PCB1.A10 73.03,8.57 73.66,9.21 95.89,9.21 97.79,11.11 97.79,48.26 95.57,50.48 FLOW.2
FLOW_DIG
  Bottom 0.61: PCB1.20 78.11,53.66 78.74,53.02 81.92,53.02 87,47.94 FLOW.3
FLOW_PWR
  Bottom 0.61: PCB1.19 75.57,53.02 76.84,51.75 81.28,51.75 85.09,47.94 85.09,40.32 85.73,39.69 R8.1 88.9,39.37 SERIAL_DEBUG.2
GND  (via drill 0.6 pad 1.93)
  Top 0.64: v69.22,34.93 v69.22,40.01 | v52.7,31.43 52.7,26.35 v45.4,19.05
  Bottom 0.254: 31.75,19.37 33.02,19.37 36.2,22.54 36.2,23.18
  Bottom 0.61: 42.55,23.18 36.2,23.18 21.91,23.18 C9.2 | U$3.P$20 42.55,20.64 | U$3.P$1 25.4,20.64 | U$3.P$10 25.4,32.07 | C7.2 69.54,22.86 ENCODER.3
  Bottom 0.64: T5.E 52.07,30.8 v52.7,31.43
  pour Bottom: 0,57.79 0,0 96.2,0 100.65,5.08 100.97,53.98 97.79,57.79
I2E_POT
  Bottom 0.61: PCB1.A2 50.16,14.29 56.52,20.64 58.42,20.64 I/E_RATIO.S
LCD_BKL
  Bottom 0.61: R7.1 62.23,54.29 PCB1.14
LCD_DB4
  Bottom 0.64: U1.11 58.17,45.65 57.47,46.36 53.34,46.36 47.62,52.07 PCB1.4
LCD_DB5
  Bottom 0.61: 54.99,55.18 PCB1.1 55.24,48.58 56.2,47.62 58.42,47.62 60.71,45.33 U1.12
LCD_DB6
  Top 0.61: U1.13 63.25,45.33 61.59,46.99 46.35,46.99 40.01,53.34 PCB1.7
LCD_DB7
  Bottom 0.61: PCB1.0 57.78,54.61 56.52,53.34 56.52,49.21 57.15,48.58 59.37,48.58 62.23,46.36 64.14,46.36 65.41,45.4 65.41,45.1 U1.14
LCD_E
  Bottom 0.64: U1.6 45.47,54.54 PCB1.5
LCD_RS
  Bottom 0.64: U1.4 40.39,45.15 42.55,47.31 PCB1.6
LED_GREEN
  Bottom 0.61: PCB1.16 67.95,53.66 73.66,47.94 78.74,47.94 79.38,47.31 LED_GREEN.A
LED_POWER
  Bottom 0.61: PCB1.15 65.41,54.61 73.66,46.36 LED_POWER.A
LED_RED
  Bottom 0.61: PCB1.17 70.48,53.02 74.3,49.21 80.01,49.21 81.92,47.31 LED_RED.A
LIMIT_SW
  Bottom 0.61: PCB1.13 23.18,54.93 20.95,52.71 20.42,52.71 LIMIT_SW.3
MODE_SWITCH
  Bottom 0.61: PCB1.A4 55.24,14.29 56.52,15.56 58.42,15.56 VOL/ASS-CTRL.2
MOTOR_DIR  (via drill 0.8 pad 1.93, 1 pad 1.93)
  Top 0.61: v21.46,28.26 41.69,28.26 43.83,30.39 43.83,30.49 v44.13,30.8
  Bottom 0.61: 25.4,28.26 U$3.P$7 v21.46,28.26 18.73,28.26 R17.1 18.1,28.58 17.78,28.26 17.14,28.26 16.51,28.89 16.51,36.83 18.1,39.37 23.81,39.37 25.72,41.28 25.72,43.82 21.91,47.62 21.91,51.75 23.18,53.02 24.77,53.02 25.72,53.97 25.72,54.86 PCB1.12 | R18.2 45.72,30.8 v44.13,30.8 43.18,29.53 U$3.P$13
MOTOR_PWM  (via drill 0.6 pad 1.93, 0.8 pad 1.93)
  Top 0.61: v21.59,37.15 v21.59,30.8 23.81,33.02 45.09,33.02 46.35,31.75 v46.35,28.89
  Bottom 0.61: U$3.P$8 22.86,29.53 v21.59,30.8 | v21.59,37.15 26.04,37.15 28.89,40.01 28.89,44.45 31.75,47.31 31.75,51.12 32.07,51.43 36.83,51.43 38.1,52.71 38.1,56.2 38.73,56.83 49.85,56.83 49.85,54.93 PCB1.3 | U$3.P$14 45.72,28.26 v46.35,28.89
MOTOR_SENSE  (via drill 1 pad 1.93)
  Top 0.61: v34.29,4.13 v16.19,4.13
  Bottom 0.61: v34.29,4.13 67.31,4.13 67.95,4.76 PCB1.A8 | R13.2 20.32,11.43 | 20.32,11.43 20.32,9.84 16.19,5.71 v16.19,4.13 | U2.1 19.05,14.29 20.32,13.02 20.32,11.43
N$1
  Bottom 0.61: T2.B 94.93,38.1 94.62,37.78 92.08,37.78 91.44,38.42 91.44,39.37 R8.2
N$2
  Bottom 0.61: R9.1 T2.C
N$3
  Bottom 0.61: FLOW.4 93.66,45.4 R9.2
N$4
  Bottom 0.61: BUZZER.- 10.16,8.57 10.16,9.99 T1.C
N$5
  Bottom 0.406: T1.B 6.35,9.21 5.4,10.16 R6.2
N$6
  Bottom 0.61: 65.26,48.9 T4.C 65.23,49.21 67.63,49.21 R2.1
N$7
  Bottom 0.61: R7.2 63.67,50.8 T4.B
N$9
  Bottom 0.61: R15.1 63.18,13.34 VOL/ASS-CTRL.3
N$11
  Bottom 0.61: R16.1 R15.2
N$12
  Bottom 1.27: JP1.1 JP1.2 EMERGENCY_STOP.2
N$13
  Bottom 1.27: FUSE.1 EMERGENCY_STOP.1
N$14
  Bottom 0.61: R17.2 18.41,31.9 T3.B
N$15
  Bottom 0.61: R18.1 49.99,33.33 T5.B
N$16
  Bottom 0.61: PCB1.RESET 27.3,3.18 C16.1
N$17
  Bottom 0.305: 21.27,15.87 21.27,15.56 | 21.27,15.56 21.27,15.24 | 20.95,15.56 21.27,15.56 | 21.27,15.56 21.59,15.56
N$19
  Bottom 0.254: 27.3,19.37 27.3,19.05 | 27.3,19.05 27.3,18.73 | 26.99,19.05 27.3,19.05 | 27.3,19.05 27.62,19.05
N$21  (via drill 0.8 pad 2.18)
  other vias: 9.84,14.29
N$34
  Bottom 0.61: U1.16 70.87,45.97 R2.2
N$37
  Bottom 0.61: 37.46,48.58 R1.S 37.15,47.31 37.85,46.61 U1.3
N$38
  Bottom 0.61: LED_GREEN.K R4.2
N$39
  Bottom 0.61: R3.2 LED_POWER.K
N$40
  Bottom 0.61: R5.2 LED_RED.K
OPV_FEEDBACK
  Bottom 0.305: R13.1 R14.2
  Bottom 0.61: R13.1 17.78,12.7 U2.2
OUT1
  Bottom 0.61: 25.4,24.45 U$3.P$4 29.84,24.45 29.84,32.7 33.34,36.19 45.44,36.19 U$2.P$2
  Bottom 1.016: SJ1.1 51.12,25.08 55.24,29.21 64.14,29.21 65.09,30.16 65.09,32.94 MOTOR_CON.1 64.38,33.65 MOTOR.1
  Bottom 1.27: MOTOR.1 MOTOR.2 55.56,33.65 51.75,37.47 51.4,37.47 U$10.P$1 U$2.P$2
OUT2
  Bottom 0.61: 25.4,25.72 U$3.P$5 28.57,25.72 28.57,34.29 31.43,37.15
  Bottom 0.64: 31.43,37.15 36.83,42.54 45.09,42.54 46.32,41.31 46.35,41.31 46.71,40.96 U$4.P$2
  Bottom 1.016: MOTOR.4 57.78,36.51 57.78,41.59 57.15,42.86 51.44,42.86 51.44,42.23 51.4,42.19 U$9.P$1 | SJ2.1 51.12,22.54 56.2,27.62 65.72,27.62 69.85,31.75 71.76,31.75 71.76,37.47 65.01,37.47 MOTOR_CON.2 62.94,37.22 61.91,36.19 MOTOR.3
  Bottom 1.27: MOTOR.4 MOTOR.3 | 47.02,40.92 U$4.P$2 U$9.P$1 51.12,41.28
OUT3
  Bottom 0.61: U$3.P$16 44.96,25.72 SJ1.2
OUT4
  Bottom 0.61: U$3.P$17 43.69,24.45 SJ2.2
PRESSURE
  Bottom 0.61: PCB1.A5 57.78,9.21 58.42,9.84 66.04,9.84 67.31,11.11 83.82,11.11 84.77,12.07 84.77,14.6 85.98,15.81 | 85.98,15.81 85.6,16.19 PRESS_SENSOR.2 83.19,16.19 | 85.98,15.81 U$1.4
RATE_POT
  Bottom 0.61: PCB1.A1 47.62,14.29 56.52,23.18 58.42,23.18 RESP_RATE.S
RESET
  Bottom 0.61: PCB1.A11 75.57,4.13 74.3,2.54 31.43,2.54 30.48,3.49 C16.2
SENSE  (via drill 1 pad 1.93)
  Top 0.61: v23.49,16.19 v29.21,16.19
  Bottom 0.305: R12.1 30.48,16.83
  Bottom 0.61: U$3.P$2 27.94,21.91 | U$3.P$19 39.37,21.91 | v23.49,16.19 23.49,16.83 22.22,18.1 17.14,18.1 16.51,17.46 U2.3 16.51,14.29 | v29.21,16.19 29.36,16.34 R12.1 | U$3.P$19 42.55,21.91 | U$3.P$19 38.1,21.91 | U$3.P$2 25.4,21.91 | U$3.P$2 29.21,21.91
  Bottom 1.27: 29.21,21.91 29.21,18.1 30.48,16.83 36.83,16.83 38.1,18.1 38.1,21.91
SILENCE_BUTTON
  Bottom 0.61: SILENCE.3 25.62,51.33 28.26,53.97 28.26,54.86 PCB1.11
VOL_POT
  Bottom 0.61: TIDAL_VOL.S 58.42,25.72 56.52,25.72 55.88,25.08 55.88,24.45 45.09,13.65 PCB1.A0

### Text on the board
tNames: Contrast | GND | GND | GND | GND | + | + | + | 1 | 2 | LCD | 15 | 16 | +5V / ANA / DIG / PWR / GND | - - - / + + + | TX1 / RX1 / GND | IST | respirator | GND | +5V | IST Austria / Respirator 4.2020 / from MIT / mshop@ist.ac.at | +5V / ENC_A / GND / ENC_B | + + / - - | +5V | 24VDC min. 2A | +5V / V_out / GND | GND | BUZZER | + | +5V
bNames: MPX5010DP